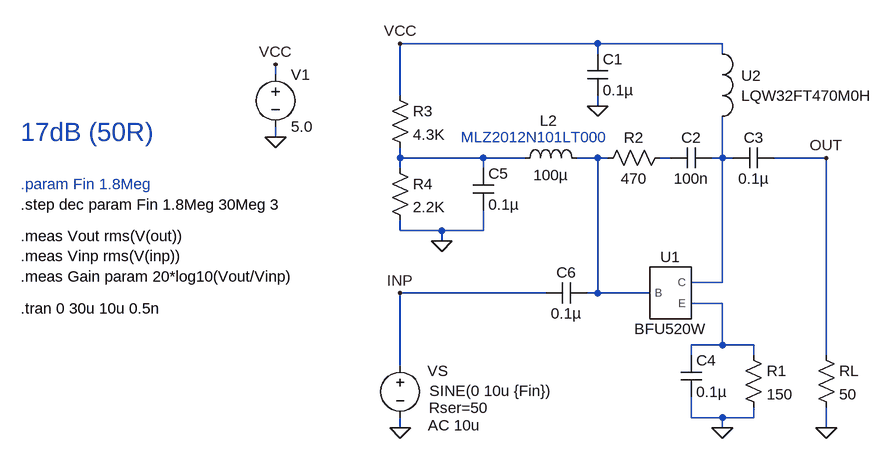
[diagram p0: schematic LNA.asc]
LNA.asc, the LTspice schematic file:
Version 4
SHEET 1 1316 680
WIRE 160 -304 -144 -304
WIRE 352 -304 160 -304
WIRE 160 -288 160 -304
WIRE 352 -288 352 -304
WIRE -336 -256 -336 -272
WIRE -144 -224 -144 -304
WIRE 160 -208 160 -224
WIRE -336 -160 -336 -176
WIRE -144 -128 -144 -144
WIRE -16 -128 -144 -128
WIRE 48 -128 -16 -128
WIRE 160 -128 128 -128
WIRE 176 -128 160 -128
WIRE 272 -128 256 -128
WIRE 352 -128 352 -192
WIRE 352 -128 336 -128
WIRE 368 -128 352 -128
WIRE 512 -128 432 -128
WIRE -144 -112 -144 -128
WIRE -16 -112 -16 -128
WIRE -144 -16 -144 -32
WIRE -80 -16 -144 -16
WIRE -16 -16 -16 -48
WIRE -16 -16 -80 -16
WIRE -80 0 -80 -16
WIRE 352 64 352 -128
WIRE 352 64 304 64
WIRE 80 80 -144 80
WIRE 160 80 160 -128
WIRE 160 80 144 80
WIRE 240 80 160 80
WIRE 352 96 304 96
WIRE 352 160 352 96
WIRE 352 160 304 160
WIRE 400 160 352 160
WIRE 304 176 304 160
WIRE 400 176 400 160
WIRE 512 176 512 -128
WIRE -144 192 -144 80
WIRE 304 272 304 240
WIRE 352 272 304 272
WIRE 400 272 400 256
WIRE 400 272 352 272
WIRE -144 288 -144 272
WIRE 352 288 352 272
WIRE 512 288 512 256
FLAG -144 288 0
FLAG -144 80 INP
FLAG 160 -208 0
FLAG 352 288 0
FLAG -144 -304 VCC
FLAG -336 -160 0
FLAG -336 -272 VCC
FLAG 512 288 0
FLAG 512 -128 OUT
FLAG -80 0 0
SYMBOL res 496 160 R0
SYMATTR InstName RL
SYMATTR Value 50
SYMBOL cap 144 -288 R0
SYMATTR InstName C1
SYMATTR Value 0.1µ
SYMBOL voltage -336 -272 R0
WINDOW 123 0 0 Left 0
WINDOW 39 0 0 Left 0
SYMATTR InstName V1
SYMATTR Value 5.0
SYMBOL res 272 -144 R90
WINDOW 0 0 56 VBottom 2
WINDOW 3 32 56 VTop 2
SYMATTR InstName R2
SYMATTR Value 470
SYMBOL cap 432 -144 R90
WINDOW 0 0 32 VBottom 2
WINDOW 3 32 32 VTop 2
SYMATTR InstName C3
SYMATTR Value 0.1µ
SYMBOL cap 336 -144 R90
WINDOW 0 0 32 VBottom 2
WINDOW 3 32 32 VTop 2
SYMATTR InstName C2
SYMATTR Value 100n
SYMBOL res 384 160 R0
SYMATTR InstName R1
SYMATTR Value 150
SYMBOL cap 288 176 R0
SYMATTR InstName C4
SYMATTR Value 0.1µ
SYMBOL res -160 -240 R0
SYMATTR InstName R3
SYMATTR Value 4.3K
SYMBOL res -160 -128 R0
SYMATTR InstName R4
SYMATTR Value 2.2K
SYMBOL cap -32 -112 R0
SYMATTR InstName C5
SYMATTR Value 0.1µ
SYMBOL ind 32 -112 R270
WINDOW 0 58 53 VTop 2
WINDOW 3 5 56 VBottom 2
SYMATTR InstName L2
SYMATTR Value 100µ
SYMATTR SpiceLine Ipk=30m Rser=3.5 Rpar=55K Cpar=1.169p
SYMBOL cap 144 64 R90
WINDOW 0 0 32 VBottom 2
WINDOW 3 32 32 VTop 2
SYMATTR InstName C6
SYMATTR Value 0.1µ
SYMBOL voltage -144 176 R0
WINDOW 0 42 24 Left 2
WINDOW 3 45 55 Left 2
WINDOW 123 43 108 Left 2
WINDOW 39 44 81 Left 2
SYMATTR InstName VS
SYMATTR Value SINE(0 10u {Fin})
SYMATTR Value2 AC 10u
SYMATTR SpiceLine Rser=50
SYMBOL BFU520W 272 80 R0
SYMATTR InstName U1
SYMBOL LQW32FT470M0H 352 -240 R90
WINDOW 0 -15 -29 VLeft 2
WINDOW 3 16 -29 VLeft 2
SYMATTR InstName U2
TEXT -728 104 Left 2 !.tran 0 30u 10u 0.5n
TEXT -728 -168 Left 4 ;17dB (50R)
TEXT 64 -160 Center 2 ;MLZ2012N101LT000
TEXT -728 -56 Left 2 !.step dec param Fin 1.8Meg 30Meg 3
TEXT -728 -8 Left 2 !.meas Vout rms(V(out))\n.meas Vinp rms(V(inp))\n.meas Gain param 20*log10(Vout/Vinp)
TEXT -728 -88 Left 2 ;.param Fin 1.8Meg

The netlist it stands for:
* LNA.asc
RL OUT 0 50
C1 VCC 0 0.1µ
V1 VCC 0 5.0
R2 N003 N002 470
C3 OUT N004 0.1µ
C2 N004 N003 100n
R1 N005 0 150
C4 N005 0 0.1µ
R3 VCC N001 4.3K
R4 N001 0 2.2K
C5 N001 0 0.1µ
L2 N001 N002 100µ Ipk=30m Rser=3.5 Rpar=55K Cpar=1.169p
C6 N002 INP 0.1µ
VS INP 0 SINE(0 10u {Fin}) AC 10u Rser=50
XU1 N004 N002 N005 BFU520W  ; pins C B E
XU2 VCC N004 LQW32FT470M0H  ; pins port1 port2
.tran 0 30u 10u 0.5n
* 17dB (50R)
* MLZ2012N101LT000
.step dec param Fin 1.8Meg 30Meg 3
.meas Vout rms(V(out))
.meas Vinp rms(V(inp))
.meas Gain param 20*log10(Vout/Vinp)
* .param Fin 1.8Meg
.lib BFU520W_SPICE_GP.PRM
.lib LQW32FT470M0H.mod
.backanno
.end